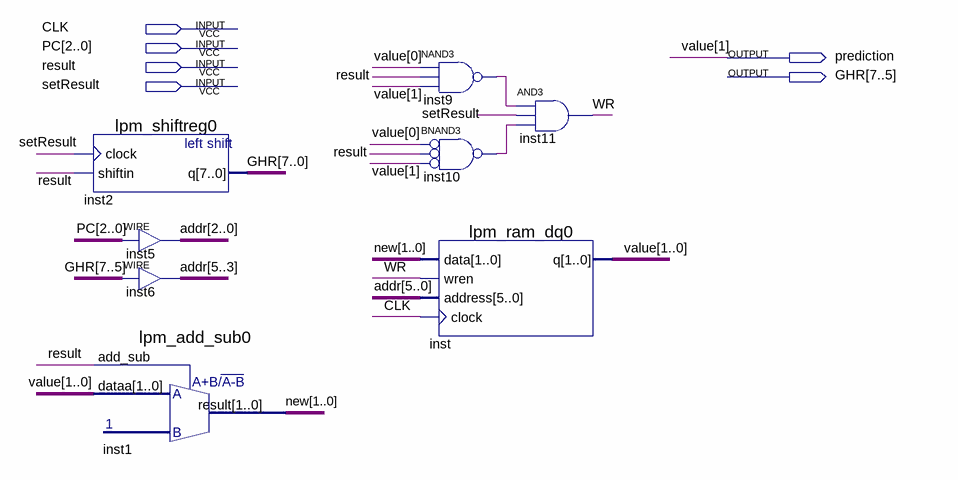
[diagram p0: schematic sheet]
// Quartus schematic Lab8.bdf as structural Verilog: 8 symbols, 6 pins
module Lab8 (
  input  CLK,
  input  [2:0] PC,
  input  result,
  input  setResult,
  output prediction,
  output [7:0] GHR
);

  wire inst9_out, inst10_out, WR;
  wire [0:0] value;
  wire [1:0] \new ;
  wire [5:0] addr;

  lpm_shiftreg0 inst2 (.clock(setResult), .shiftin(result), .q(GHR));
  lpm_add_sub0 inst1 (.dataa({prediction, value[0]}), .add_sub(result), .result(\new ));
  assign addr[2:0] = PC;  // WIRE inst5
  assign addr[5:3] = GHR[7:5];  // WIRE inst6
  nand inst9 (inst9_out, value[0], result, prediction);
  nand inst10 (inst10_out, ~value[0], ~result, ~prediction);  // BNAND3
  lpm_ram_dq0 inst (.data(\new ), .wren(WR), .address(addr), .clock(CLK), .q({prediction, value[0]}));
  and inst11 (WR, inst9_out, setResult, inst10_out);

  // Other names for the same wires on the sheet: value[1] = prediction
endmodule
